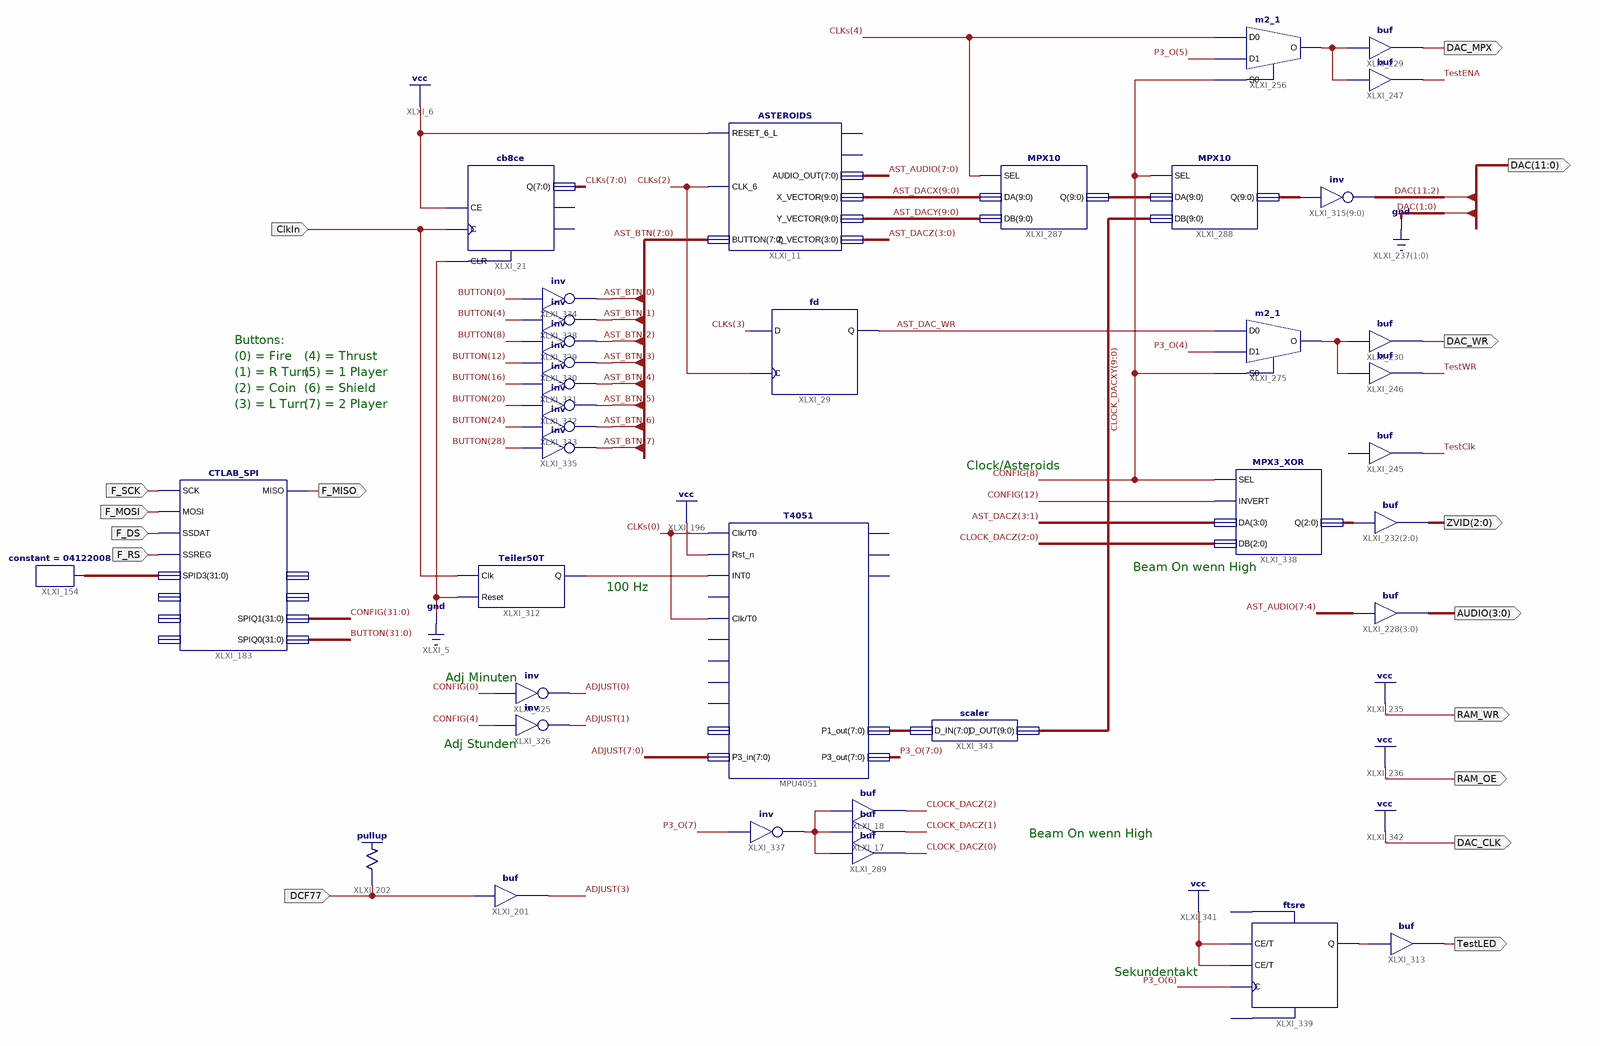
[diagram p0: schematic sheet 1]
// Xilinx ISE schematic AsteroidsClock.sch (spartan3) as structural Verilog: 39 symbols, 16 ports
module AsteroidsClock (
  input  ClkIn,
  input  DCF77,
  input  F_SCK,
  input  F_MOSI,
  input  F_DS,
  input  F_RS,
  output F_MISO,
  output DAC_MPX,
  output [3:0] AUDIO,
  output RAM_WR,
  output RAM_OE,
  output DAC_WR,
  output [11:0] DAC,
  output [2:0] ZVID,
  output TestLED,
  output DAC_CLK
);

  wire AST_DAC_WR, TestClk, TestENA, TestWR, XLXN_434, XLXN_437, XLXN_504, XLXN_560, XLXN_570;
  wire [2:0] CLOCK_DACZ, XLXN_562;
  wire [3:0] AST_DACZ;
  wire [7:0] ADJUST, AST_AUDIO, AST_BTN, CLKs, P3_O, XLXN_572;
  wire [9:0] AST_DACX, AST_DACY, CLOCK_DACXY, XLXN_383, XLXN_519;
  wire [31:0] BUTTON, CONFIG, XLXN_306;

  ASTEROIDS XLXI_11 (
    .RESET_6_L(1'b1), .CLK_6(CLKs[2]), .BUTTON(AST_BTN), .AUDIO_OUT(AST_AUDIO), .X_VECTOR(AST_DACX),
    .Y_VECTOR(AST_DACY), .Z_VECTOR(AST_DACZ));  // open: BEAM_ON, BEAM_ENA
  cb8ce XLXI_21 (.C(ClkIn), .CE(1'b1), .CLR(1'b0), .Q(CLKs));  // open: CEO, TC
  fd XLXI_29 (.C(CLKs[2]), .D(CLKs[3]), .Q(AST_DAC_WR));
  T4051 MPU4051 (
    .Clk(CLKs[0]), .Rst_n(1'b1), .INT0(XLXN_504), .T0(CLKs[0]), .P3_in(ADJUST), .P1_out(XLXN_572),
    .P3_out(P3_O));  // open: INT1, T1, T2, T2EX, P1_in, RXD_IsO, RXD_O, TXD, RXD
  buf XLXI_201 (ADJUST[3], DCF77);
  \pullup  XLXI_202 (.O(DCF77));
  CTLAB_SPI XLXI_183 (
    .SCK(F_SCK), .MOSI(F_MOSI), .SSDAT(F_DS), .SSREG(F_RS), .SPIQ0(BUTTON), .SPIQ1(CONFIG), .MISO(F_MISO),
    .SPID3(XLXN_306));  // open: SPIQ2, SPIQ3, SPID0, SPID1, SPID2
  constant #(.CValue("04122008")) XLXI_154 (.O(XLXN_306));
  m2_1 XLXI_256 (.D0(CLKs[4]), .D1(P3_O[5]), .S0(CONFIG[8]), .O(XLXN_434));
  buf XLXI_229 (DAC_MPX, XLXN_434);
  assign AUDIO = AST_AUDIO[7:4];  // buf XLXI_228[3..0], 4 bits wide
  buf XLXI_230 (DAC_WR, XLXN_437);
  m2_1 XLXI_275 (.D0(AST_DAC_WR), .D1(P3_O[4]), .S0(CONFIG[8]), .O(XLXN_437));
  buf XLXI_247 (TestENA, XLXN_434);
  buf XLXI_246 (TestWR, XLXN_437);
  MPX10 XLXI_287 (.DA(AST_DACX), .DB(AST_DACY), .Q(XLXN_383), .SEL(CLKs[4]));
  MPX10 XLXI_288 (.DA(XLXN_383), .DB(CLOCK_DACXY), .Q(XLXN_519), .SEL(CONFIG[8]));
  buf XLXI_18 (CLOCK_DACZ[2], XLXN_560);
  buf XLXI_17 (CLOCK_DACZ[1], XLXN_560);
  buf XLXI_289 (CLOCK_DACZ[0], XLXN_560);
  Teiler50T XLXI_312 (.Clk(ClkIn), .Reset(1'b0), .Q(XLXN_504));
  assign DAC[11:2] = ~XLXN_519;  // inv XLXI_315[9..0], 10 bits wide
  not XLXI_325 (ADJUST[0], CONFIG[0]);
  not XLXI_326 (ADJUST[1], CONFIG[4]);
  not XLXI_328 (AST_BTN[1], BUTTON[4]);
  not XLXI_329 (AST_BTN[2], BUTTON[8]);
  not XLXI_330 (AST_BTN[3], BUTTON[12]);
  not XLXI_331 (AST_BTN[4], BUTTON[16]);
  not XLXI_332 (AST_BTN[5], BUTTON[20]);
  not XLXI_333 (AST_BTN[6], BUTTON[24]);
  not XLXI_334 (AST_BTN[0], BUTTON[0]);
  not XLXI_335 (AST_BTN[7], BUTTON[28]);
  not XLXI_337 (XLXN_560, P3_O[7]);
  // buf XLXI_245 has open pins: I=open, O=TestClk
  assign ZVID = XLXN_562;  // buf XLXI_232[2..0], 3 bits wide
  MPX3_XOR XLXI_338 (.SEL(CONFIG[8]), .INVERT(CONFIG[12]), .DA(AST_DACZ[3:1]), .DB(CLOCK_DACZ), .Q(XLXN_562));
  ftsre XLXI_339 (.C(P3_O[6]), .CE(1'b1), .T(1'b1), .Q(XLXN_570));  // open: R, S
  buf XLXI_313 (TestLED, XLXN_570);
  scaler XLXI_343 (.D_IN(XLXN_572), .D_OUT(CLOCK_DACXY));

  assign DAC[1:0] = 2'b00;
  assign DAC_CLK = 1'b1;
  assign RAM_OE = 1'b1;
  assign RAM_WR = 1'b1;

  // Notes on the sheet:
  //   Buttons:
  //   (0) = Fire
  //   (4) = Thrust
  //   (1) = R Turn
  //   (5) = 1 Player
  //   (2) = Coin
  //   (6) = Shield
  //   (3) = L Turn
  //   (7) = 2 Player
  //   Clock/Asteroids
  //   Beam On wenn High
  //   100 Hz
  //   Adj Minuten
  //   Adj Stunden
  //   Beam On wenn High
  //   Sekundentakt
endmodule
